# Altium schematic sheet rs485.SchDoc: RS485
size A4; Author: Marcel Hellwig; Organization: Hamburg Bit-Bots; Address1: Vogt-Kölln-Str. 30; Address2: 22527 Hamburg; Address3: Germany; Address4: www.bit-bots.de; DocumentNumber: 11; Revision: A; SheetNumber: 11; SheetTotal: 16; EMail: info@bit-bots.de
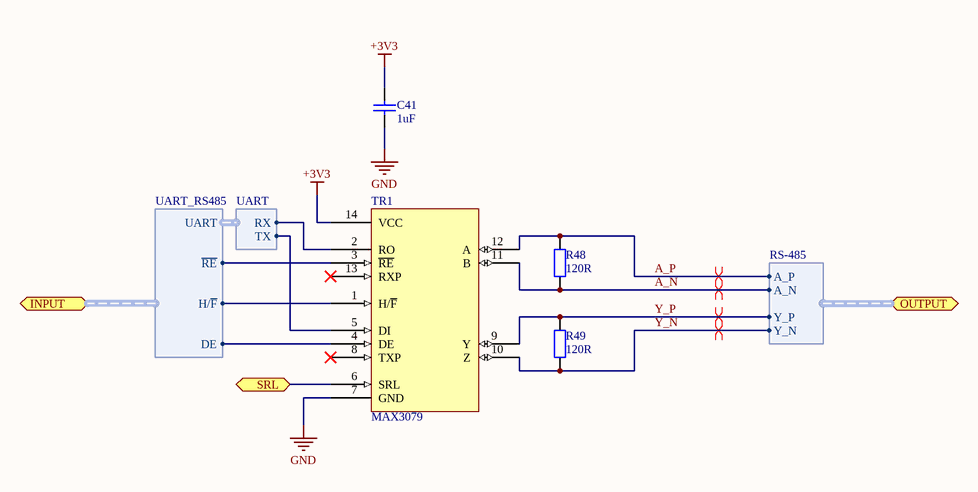
[diagram p0: rs485.SchDoc]

## Parts
C41  1uF  [C2012]
R48  120R  [R2012]
R49  120R  [R2012]
TR1  MAX3079  [SOIC14]

## Ports
INPUT (harness UART_RS485), OUTPUT (harness RS-485), SRL (bidir)

## Harnesses
UART_RS485: ~{RE}, UART, DE, H/~{F}
UART: RX, TX
RS-485: A_N, A_P, Y_N, Y_P

## Nets
+3V3: C41.1 TR1.14(VCC)
GND: C41.2 TR1.7(GND)
A_N: R48.1 TR1.11(B) ; port OUTPUT.A_N
A_P: R48.2 TR1.12(A) ; port OUTPUT.A_P
SRL: TR1.6(SRL) ; port SRL
Y_N: R49.2 TR1.10(Z) ; port OUTPUT.Y_N
Y_P: R49.1 TR1.9(Y) ; port OUTPUT.Y_P
NetTR1_1: TR1.1(H/~{F}) ; port INPUT.H/~{F}
NetTR1_2: TR1.2(RO) ; harness UART.RX
NetTR1_3: TR1.3(~{RE}) ; port INPUT.~{RE}
NetTR1_4: TR1.4(DE) ; port INPUT.DE
NetTR1_5: TR1.5(DI) ; harness UART.TX

Not connected (* = marked no-connect by the designer): TR1 8(TXP)* 13(RXP)*

## Layout directives
differential pair: A_N, A_P, Y_N, Y_P

## Notes on the sheet
- Project:
- Author:
- Title:
- Rev:
- Date:
- Time:
- Sheet
- of

## Library data of the parts
C41 = Cap: Capacitor; Manufacturer: MULTICOMP; Manufacturer Part Number: MC0805B105K250CT; Produktpalette: Baureihe MC; Kapazität: 1; Kapazitätstoleranz: ±10%; Dielektrikum: X7; Nennspannung: 25; Keramikkondensatorgehäuse: 0805 [Metrisch 2012]; Betriebstemperatur, min.: -55; Betriebstemperatur, max.: 125; Verpackung: Gurtabschnitt; Kondensatoranschlüsse: SMD<!--FANDB--><div class="features-and-benefits-container"></div>; Published: 8-Jun-2000; LatestRevisionDate: 17-Jul-2002; LatestRevisionNote: Re-released for DXP Platform.; PackageReference: RAD-0.3; Publisher: Altium Limited; PackageDescription: Radial Cap, Thru-Hole; 2 Leads; 0.3 in Pin Spacing; Value: 1uF; Supplier 1: Farnell; Supplier Part Number 1: 2320827; RoHS: YES; Stock 1: 4031; Pricing 1: 10=0,06, 100=0,05, 500=0,041, 1000=0,034, 1500=0,027 (EUR); MSL: MSL 1 - unbegrenzt; Bauform: 0805 [Metrisch 2012]; Kapazitätstoleranz ±: ±10%; ComponentLink1URL: http://www.farnell.com/datasheets/1870456.pdf; ComponentLink1Description: http://www.farnell.com/datasheets/1870456.pdf
R48 R49 = Res2: Resistor; Manufacturer: MULTICOMP; Manufacturer Part Number: MCMR08X1200FTL; Produktpalette: Baureihe MCMR; Widerstand: 120; Nennleistung: 125; Widerstandstoleranz: ±1%; Bauform: 0805 [Metrisch 2012]; Widerstandselement: Keramik; Temperaturkoeffizient: ±100; Nennspannung: 150; Verpackung: Gurtabschnitt; SVHC: No SVHC (17-Dec-2014); Widerstandsmontage: Oberflächenmontage<!--FANDB--><div class="features-and-benefits-container"></div>; Published: 8-Jun-2000; LatestRevisionDate: 17-Jul-2002; LatestRevisionNote: Re-released for DXP Platform.; PackageReference: AXIAL-0.4; Publisher: Altium Limited; PackageDescription: Axial Device, Thru-Hole; 2 Leads; 0.4 in Pin Spacing; Value: 120R; Supplier 1: Farnell; Supplier Part Number 1: 2073624; RoHS: YES; Stock 1: 7400; Pricing 1: 100=0,014, 500=0,011, 1000=0,01 (EUR); MSL: -; ComponentLink1URL: http://www.farnell.com/datasheets/1716708.pdf; ComponentLink1Description: http://www.farnell.com/datasheets/1716708.pdf
TR1 = MAX3079: MAX3079 RS485-Transreceiver; Supplier 1: Farnell; Supplier Part Number 1: 1379892